# EAGLE design spine (EAGLE 9.4.2)

## Sheet 1 of 3: Leg COM
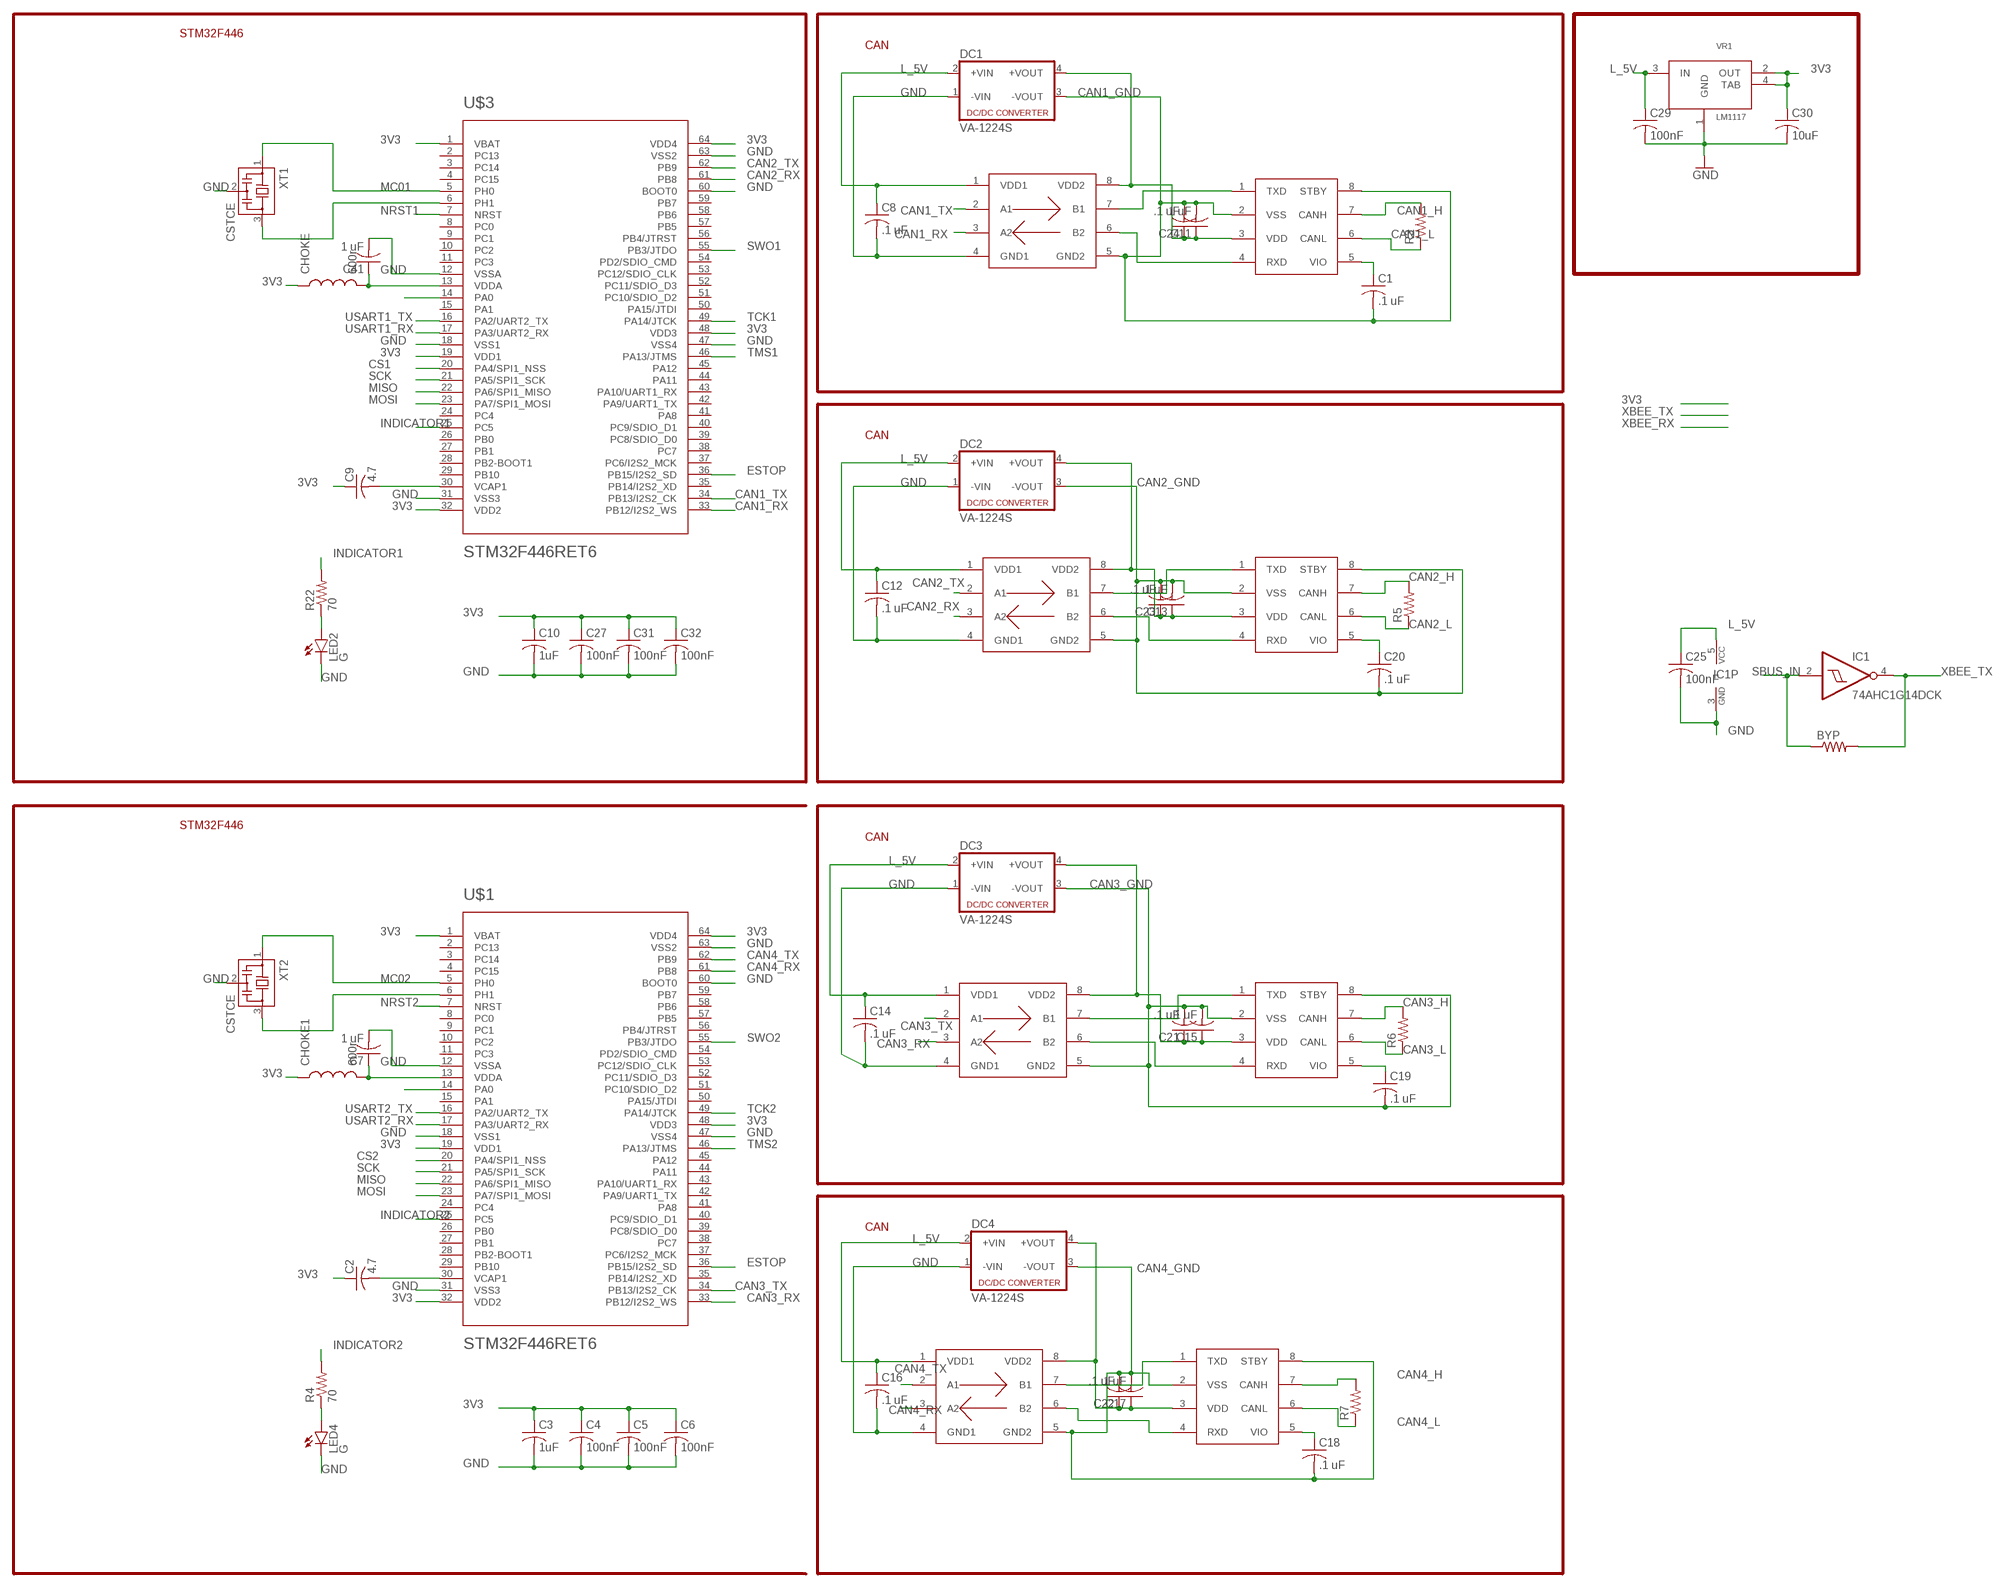
[diagram p0: schematic, sheet 1]

### Parts
BYP  R-US_R0402  [R0402]
C1  .1 uF  C-USC0603K  [C0603K]
C2  4.7  C-USC0603  [C0603]
C3  1uF  C-USC0603  [C0603]
C4  100nF  C-USC0603  [C0603]
C5  100nF  C-USC0603  [C0603]
C6  100nF  C-USC0603  [C0603]
C7  1 uF  C-USC0603  [C0603]
C8  .1 uF  C-USC0603K  [C0603K]
C9  4.7  C-USC0603  [C0603]
C10  1uF  C-USC0603  [C0603]
C11  1 uF  C-USC0603K  [C0603K]
C12  .1 uF  C-USC0603K  [C0603K]
C13  1 uF  C-USC0603K  [C0603K]
C14  .1 uF  C-USC0603K  [C0603K]
C15  1 uF  C-USC0603K  [C0603K]
C16  .1 uF  C-USC0603K  [C0603K]
C17  1 uF  C-USC0603K  [C0603K]
C18  .1 uF  C-USC0603K  [C0603K]
C19  .1 uF  C-USC0603K  [C0603K]
C20  .1 uF  C-USC0603K  [C0603K]
C21  .1 uF  C-USC0603K  [C0603K]
C22  .1 uF  C-USC0603K  [C0603K]
C23  .1 uF  C-USC0603K  [C0603K]
C24  .1 uF  C-USC0603K  [C0603K]
C25  100nF  C-USC0603  [C0603]
C27  100nF  C-USC0603  [C0603]
C29  100nF  C-USC0603  [C0603]
C30  10uF  C-USC0805K  [C0805K]
C31  100nF  C-USC0603  [C0603]
C32  100nF  C-USC0603  [C0603]
C41  1 uF  C-USC0603  [C0603]
CHOKE  600r  INDUCTOR0603  [0603]
CHOKE1  600r  INDUCTOR0603  [0603]
DC1  VA-1224S  [4SIL]
DC2  VA-1224S  [4SIL]
DC3  VA-1224S  [4SIL]
DC4  VA-1224S  [4SIL]
IC1  74AHC1G14DCK  [SC70-5]
LED2  G  LED0603  [LED-0603]
LED4  G  LED0603  [LED-0603]
R3  R-US_R0402  [R0402]
R4  70  R-US_R0603  [R0603]
R5  R-US_R0402  [R0402]
R6  R-US_R0402  [R0402]
R7  R-US_R0402  [R0402]
R22  70  R-US_R0603  [R0603]
U$1  STM32F446RET6  [TQFP64]
U$3  STM32F446RET6  [TQFP64]
U$4  MCP2561  [SO08]
U$5  MCP2561  [SO08]
U$6  MCP2561  [SO08]
U$7  MCP2561  [SO08]
U$8  SI8410  [SO08]
U$9  SI8410  [SO08]
U$10  SI8410  [SO08]
U$11  SI8410  [SO08]
VR1  LM1117  [SOT-223]
XT1  CSTCE  [CSTCE]
XT2  CSTCE  [CSTCE]

### Nets
3V3: C2.1 C3.1 C4.1 C5.1 C6.1 C9.1 C10.1 C27.1 C30.1 C31.1 C32.1 CHOKE1.1 CHOKE.1 U$1.1(VBAT) U$1.19(VDD1) U$1.32(VDD2) U$1.48(VDD3) U$1.64(VDD4) U$3.1(VBAT) U$3.19(VDD1) U$3.32(VDD2) U$3.48(VDD3) U$3.64(VDD4) VR1.2(OUT) VR1.4(TAB) ; also sheet 2
': C17.1 C22.1 DC4.4(+VOUT) U$7.3(VDD) U$11.8(VDD2)
CAN1_GND: C1.2 C11.2 C24.2 DC1.3(-VOUT) U$4.2(VSS) U$4.8(STBY) U$8.5(GND2) ; also sheet 2
CAN1_H: R3.2 U$4.7(CANH) ; also sheet 2
CAN1_L: R3.1 U$4.6(CANL) ; also sheet 2
CAN1_RX: U$3.33(PB12/I2S2_WS) U$8.3(A2)
CAN1_TX: U$3.34(PB13/I2S2_CK) U$8.2(A1)
CAN2_GND: C13.2 C20.2 C23.2 DC2.3(-VOUT) U$5.2(VSS) U$5.8(STBY) U$10.5(GND2) ; also sheet 2
CAN2_H: R5.2 U$5.7(CANH) ; also sheet 2
CAN2_L: R5.1 U$5.6(CANL) ; also sheet 2
CAN2_RX: U$3.61(PB8) U$10.3(A2)
CAN2_TX: U$3.62(PB9) U$10.2(A1)
CAN3_GND: C15.2 C19.2 C21.2 DC3.3(-VOUT) U$6.2(VSS) U$6.8(STBY) U$9.5(GND2) ; also sheet 2
CAN3_H: R6.2 U$6.7(CANH) ; also sheet 2
CAN3_L: R6.1 U$6.6(CANL) ; also sheet 2
CAN3_RX: U$1.33(PB12/I2S2_WS) U$9.3(A2)
CAN3_TX: U$1.34(PB13/I2S2_CK) U$9.2(A1)
CAN4_GND: C17.2 C18.2 C22.2 DC4.3(-VOUT) U$7.2(VSS) U$7.8(STBY) U$11.5(GND2) ; also sheet 2
CAN4_H: R7.2 U$7.7(CANH) ; also sheet 2
CAN4_L: R7.1 U$7.6(CANL) ; also sheet 2
CAN4_RX: U$1.61(PB8) U$11.3(A2)
CAN4_TX: U$1.62(PB9) U$11.2(A1)
CS1: U$3.20(PA4/SPI1_NSS) ; also sheet 3
CS2: U$1.20(PA4/SPI1_NSS) ; also sheet 3
ESTOP: U$1.36(PB15/I2S2_SD) U$3.36(PB15/I2S2_SD) ; also sheet 2
GND: C3.2 C4.2 C5.2 C6.2 C7.2 C8.2 C10.2 C12.2 C14.2 C16.2 C25.2 C27.2 C29.2 C30.2 C31.2 C32.2 C41.2 DC1.1(-VIN) DC2.1(-VIN) DC3.1(-VIN) DC4.1(-VIN) IC1.3(GND) LED2.C LED4.C U$1.12(VSSA) U$1.18(VSS1) U$1.31(VSS3) U$1.47(VSS4) U$1.60(BOOT0) U$1.63(VSS2) U$3.12(VSSA) U$3.18(VSS1) U$3.31(VSS3) U$3.47(VSS4) U$3.60(BOOT0) U$3.63(VSS2) U$8.4(GND1) U$9.4(GND1) U$10.4(GND1) U$11.4(GND1) VR1.1(GND) XT1.2 XT2.2 ; also sheet 2,3
INDICATOR1: R22.2 U$3.25(PC5)
INDICATOR2: R4.2 U$1.25(PC5)
L_5V: C8.1 C12.1 C14.1 C16.1 C25.1 C29.1 DC1.2(+VIN) DC2.2(+VIN) DC3.2(+VIN) DC4.2(+VIN) IC1.5(VCC) U$8.1(VDD1) U$9.1(VDD1) U$10.1(VDD1) U$11.1(VDD1) VR1.3(IN) ; also sheet 2,3
MC01: U$3.5(PH0) XT1.1
MC02: U$1.5(PH0) XT2.1
MISO: U$1.22(PA6/SPI1_MISO) U$3.22(PA6/SPI1_MISO) ; also sheet 3
MOSI: U$1.23(PA7/SPI1_MOSI) U$3.23(PA7/SPI1_MOSI) ; also sheet 3
N$1: U$1.14(PA0)
N$2: C41.1 CHOKE.2 U$3.13(VDDA)
N$3: C9.2 U$3.30(VCAP1)
N$4: C7.1 CHOKE1.2 U$1.13(VDDA)
N$5: C2.2 U$1.30(VCAP1)
N$6: C1.1 U$4.5(VIO)
N$7: LED4.A R4.1
N$8: U$1.6(PH1) XT2.3
N$10: C20.1 U$5.5(VIO)
N$11: C15.1 C21.1 DC3.4(+VOUT) U$6.3(VDD) U$9.8(VDD2)
N$12: C11.1 C24.1 DC1.4(+VOUT) U$4.3(VDD) U$8.8(VDD2)
N$14: U$4.1(TXD) U$8.7(B1)
N$15: U$7.1(TXD) U$11.7(B1)
N$16: U$4.4(RXD) U$8.6(B2)
N$17: U$7.4(RXD) U$11.6(B2)
N$18: C18.1 U$7.5(VIO)
N$19: C13.1 C23.1 DC2.4(+VOUT) U$5.3(VDD) U$10.8(VDD2)
N$20: U$5.1(TXD) U$10.7(B1)
N$21: U$5.4(RXD) U$10.6(B2)
N$22: C19.1 U$6.5(VIO)
N$24: U$3.14(PA0)
N$26: U$6.1(TXD) U$9.7(B1)
N$27: U$6.4(RXD) U$9.6(B2)
N$28: LED2.A R22.1
N$30: U$3.6(PH1) XT1.3
NRST1: U$3.7(NRST) ; also sheet 2
NRST2: U$1.7(NRST) ; also sheet 2
SBUS_IN: BYP.1 IC1.2(I) ; also sheet 2
SCK: U$1.21(PA5/SPI1_SCK) U$3.21(PA5/SPI1_SCK) ; also sheet 3
SWO1: U$3.55(PB3/JTDO)
SWO2: U$1.55(PB3/JTDO)
TCK1: U$3.49(PA14/JTCK) ; also sheet 2
TCK2: U$1.49(PA14/JTCK) ; also sheet 2
TMS1: U$3.46(PA13/JTMS) ; also sheet 2
TMS2: U$1.46(PA13/JTMS) ; also sheet 2
USART1_RX: U$3.17(PA3/UART2_RX) ; also sheet 2
USART1_TX: U$3.16(PA2/UART2_TX) ; also sheet 2
USART2_RX: U$1.17(PA3/UART2_RX) ; also sheet 2
USART2_TX: U$1.16(PA2/UART2_TX) ; also sheet 2
XBEE_TX: BYP.2 IC1.4(O) ; also sheet 3
Unconnected: U$1.2(PC13) U$1.3(PC14) U$1.4(PC15) U$1.8(PC0) U$1.9(PC1) U$1.10(PC2) U$1.11(PC3) U$1.15(PA1) U$1.24(PC4) U$1.26(PB0) U$1.27(PB1) U$1.28(PB2-BOOT1) U$1.29(PB10) U$1.35(PB14/I2S2_XD) U$1.37(PC6/I2S2_MCK) U$1.38(PC7) U$1.39(PC8/SDIO_D0) U$1.40(PC9/SDIO_D1) U$1.41(PA8) U$1.42(PA9/UART1_TX) U$1.43(PA10/UART1_RX) U$1.44(PA11) U$1.45(PA12) U$1.50(PA15/JTDI) U$1.51(PC10/SDIO_D2) U$1.52(PC11/SDIO_D3) U$1.53(PC12/SDIO_CLK) U$1.54(PD2/SDIO_CMD) U$1.56(PB4/JTRST) U$1.57(PB5) U$1.58(PB6) U$1.59(PB7) U$3.2(PC13) U$3.3(PC14) U$3.4(PC15) U$3.8(PC0) U$3.9(PC1) U$3.10(PC2) U$3.11(PC3) U$3.15(PA1) U$3.24(PC4) U$3.26(PB0) U$3.27(PB1) U$3.28(PB2-BOOT1) U$3.29(PB10) U$3.35(PB14/I2S2_XD) U$3.37(PC6/I2S2_MCK) U$3.38(PC7) U$3.39(PC8/SDIO_D0) U$3.40(PC9/SDIO_D1) U$3.41(PA8) U$3.42(PA9/UART1_TX) U$3.43(PA10/UART1_RX) U$3.44(PA11) U$3.45(PA12) U$3.50(PA15/JTDI) U$3.51(PC10/SDIO_D2) U$3.52(PC11/SDIO_D3) U$3.53(PC12/SDIO_CLK) U$3.54(PD2/SDIO_CMD) U$3.56(PB4/JTRST) U$3.57(PB5) U$3.58(PB6) U$3.59(PB7)

### Notes on the sheet
- STM32F446
- CAN
- CAN
- STM32F446
- CAN
- CAN

## Sheet 2 of 3: Connectors
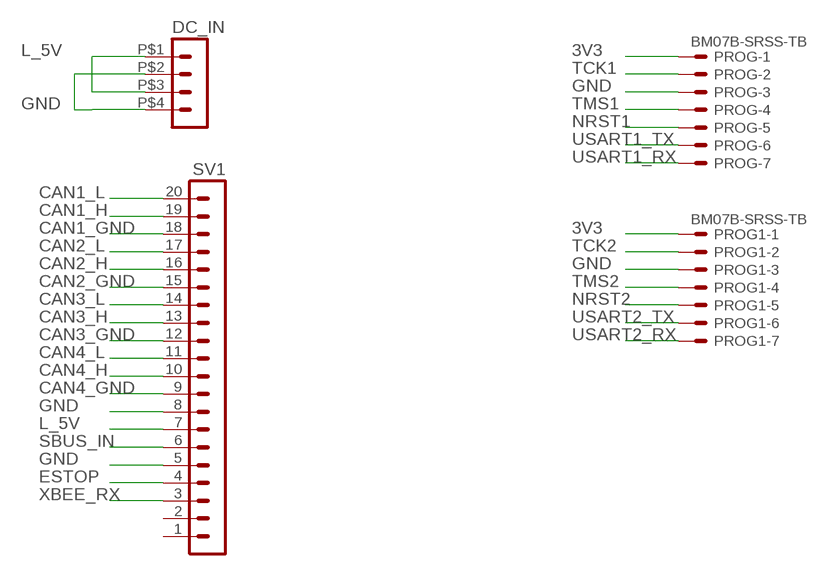
[diagram p1: schematic, sheet 2]

### Parts
DC_IN  HEADER_POS4_43045-0401  [43045-0400]
PROG  BM07B-SRSS-TB  [BM07B-SRSS-TB]
PROG1  BM07B-SRSS-TB  [BM07B-SRSS-TB]
SV1  MA20-1L  [MA20-1L]

### Nets
3V3: PROG1.1 PROG.1 ; also sheet 1
CAN1_GND: SV1.18 ; also sheet 1
CAN1_H: SV1.19 ; also sheet 1
CAN1_L: SV1.20 ; also sheet 1
CAN2_GND: SV1.15 ; also sheet 1
CAN2_H: SV1.16 ; also sheet 1
CAN2_L: SV1.17 ; also sheet 1
CAN3_GND: SV1.12 ; also sheet 1
CAN3_H: SV1.13 ; also sheet 1
CAN3_L: SV1.14 ; also sheet 1
CAN4_GND: SV1.9 ; also sheet 1
CAN4_H: SV1.10 ; also sheet 1
CAN4_L: SV1.11 ; also sheet 1
ESTOP: SV1.4 ; also sheet 1
GND: DC_IN.P$2 DC_IN.P$4 PROG1.3 PROG.3 SV1.5 SV1.8 ; also sheet 1,3
L_5V: DC_IN.P$1 DC_IN.P$3 SV1.7 ; also sheet 1,3
NRST1: PROG.5 ; also sheet 1
NRST2: PROG1.5 ; also sheet 1
SBUS_IN: SV1.6 ; also sheet 1
TCK1: PROG.2 ; also sheet 1
TCK2: PROG1.2 ; also sheet 1
TMS1: PROG.4 ; also sheet 1
TMS2: PROG1.4 ; also sheet 1
USART1_RX: PROG.7 ; also sheet 1
USART1_TX: PROG.6 ; also sheet 1
USART2_RX: PROG1.7 ; also sheet 1
USART2_TX: PROG1.6 ; also sheet 1
XBEE_RX: SV1.3 ; also sheet 1,3
Unconnected: SV1.1 SV1.2

## Sheet 3 of 3: UP Board
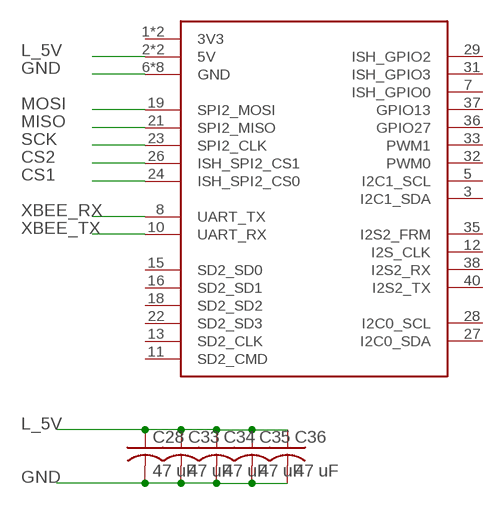
[diagram p2: schematic, sheet 3]

### Parts
C28  47 uF  C-USC1206K  [C1206K]
C33  47 uF  C-USC1206K  [C1206K]
C34  47 uF  C-USC1206K  [C1206K]
C35  47 uF  C-USC1206K  [C1206K]
C36  47 uF  C-USC1206K  [C1206K]
U$2  UP_BOARD  [UP_BOARD]

### Nets
CS1: U$2.24(ISH_SPI2_CS0) ; also sheet 1
CS2: U$2.26(ISH_SPI2_CS1) ; also sheet 1
GND: C28.2 C33.2 C34.2 C35.2 C36.2 U$2.6(GND) U$2.9(GND) U$2.14(GND) U$2.20(GND) U$2.25(GND) U$2.30(GND) U$2.34(GND) U$2.39(GND) ; also sheet 1,2
L_5V: C28.1 C33.1 C34.1 C35.1 C36.1 U$2.2(5V) U$2.4(5V) ; also sheet 1,2
MISO: U$2.21(SPI2_MISO) ; also sheet 1
MOSI: U$2.19(SPI2_MOSI) ; also sheet 1
SCK: U$2.23(SPI2_CLK) ; also sheet 1
XBEE_RX: U$2.8(UART_TX) ; also sheet 1,2
XBEE_TX: U$2.10(UART_RX) ; also sheet 1
Unconnected: U$2.1(3V3) U$2.3(I2C1_SDA) U$2.5(I2C1_SCL) U$2.7(ISH_GPIO0) U$2.11(SD2_CMD) U$2.12(I2S_CLK) U$2.13(SD2_CLK) U$2.15(SD2_SD0) U$2.16(SD2_SD1) U$2.17(3V3) U$2.18(SD2_SD2) U$2.22(SD2_SD3) U$2.27(I2C0_SDA) U$2.28(I2C0_SCL) U$2.29(ISH_GPIO2) U$2.31(ISH_GPIO3) U$2.32(PWM0) U$2.33(PWM1) U$2.35(I2S2_FRM) U$2.36(GPIO27) U$2.37(GPIO13) U$2.38(I2S2_RX) U$2.40(I2S2_TX)

## Library data of the parts
BYP = rcl:R-US_: RESISTOR, American symbol; SPICEPREFIX: R
C1-C25 C27-C36 C41 = rcl:C-US: CAPACITOR, American symbol
CHOKE CHOKE1 = SparkFun-Passives:INDUCTOR: Inductors Basic Inductor/Choke - 0603 and 1206. Footprints are not proven and vary greatly between part numbers. INDUCTOR POWER 3.3UH 4.0A SMD 0.197" L x 0.197" W x 0.177" H (5.00mm x 5.00mm x 4.50mm)
DC1-DC4 = dc-dc-converter:VA-*?: DC DC Converter Single Output, 1 Watt Motien Technology Co.,Ltd. Source: Data sheet <http://www.motien.com.tw/data_sheet/VA-1%28H%29.pdf>; OC_FARNELL: unknown; OC_NEWARK: unknown
DC_IN = con-molex-micro-fit-3_0:HEADER_POS4_?: Molex - Micro-Fit 3.0 Series connector, 3.00mm (0.118") pitch header, 4 positions.
IC1 = 74xx-little-us:74*1G14: Single Schmitt-Trigger Inverter Gate
LED2 LED4 = SparkFun-LED:LED: LEDs Standard schematic elements and footprints for 5mm, 3mm, 1206, and 0603 sized LEDs. 5mm - Spark Fun Electronics SKU : COM-00529 (and others)
PROG PROG1 = con-jst2:?M07B-SRSS-TB: Disconnectable Crimp style connector, 1.0mm pitch 7 contacts
R3-R7 R22 = rcl:R-US_: RESISTOR, American symbol
SV1 = con-lstb:MA20-1L: PIN HEADER; OC_FARNELL: unknown; OC_NEWARK: unknown
U$1 U$3 = BenLibrary:STM32F446RET6: ARM DSP Chip used on the WAV Trigger board.
U$2 = BenLibrary:UP_BOARD
U$4-U$7 = BenLibrary:MCP2561
U$8-U$11 = BenLibrary:SI8410
VR1 = sc_usercreated:LM1117
XT1 XT2 = sc_usercreated:CSTCE

## Board
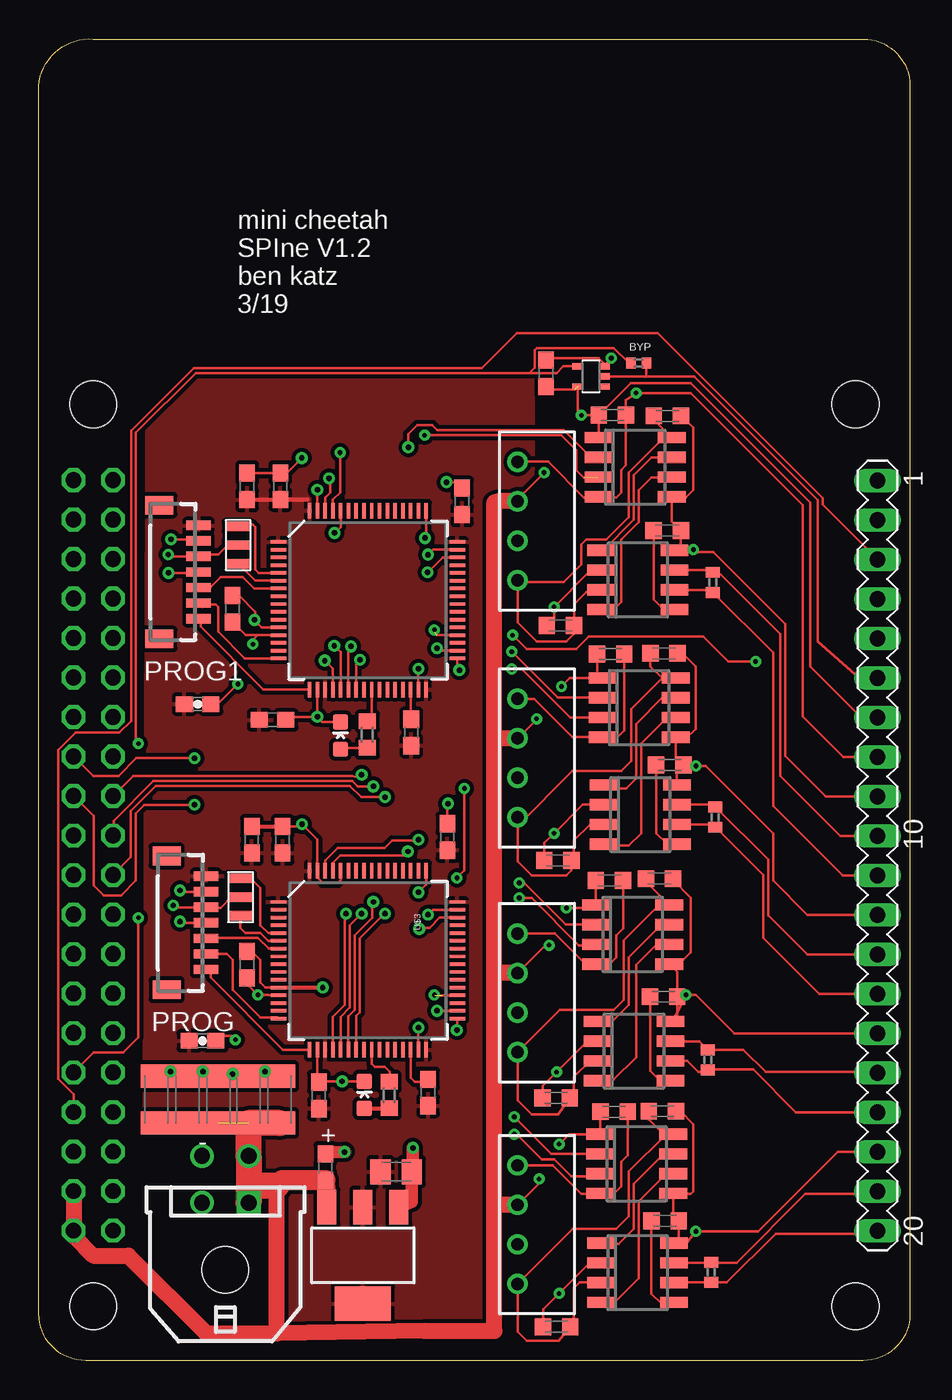
[diagram p3: board, top side]
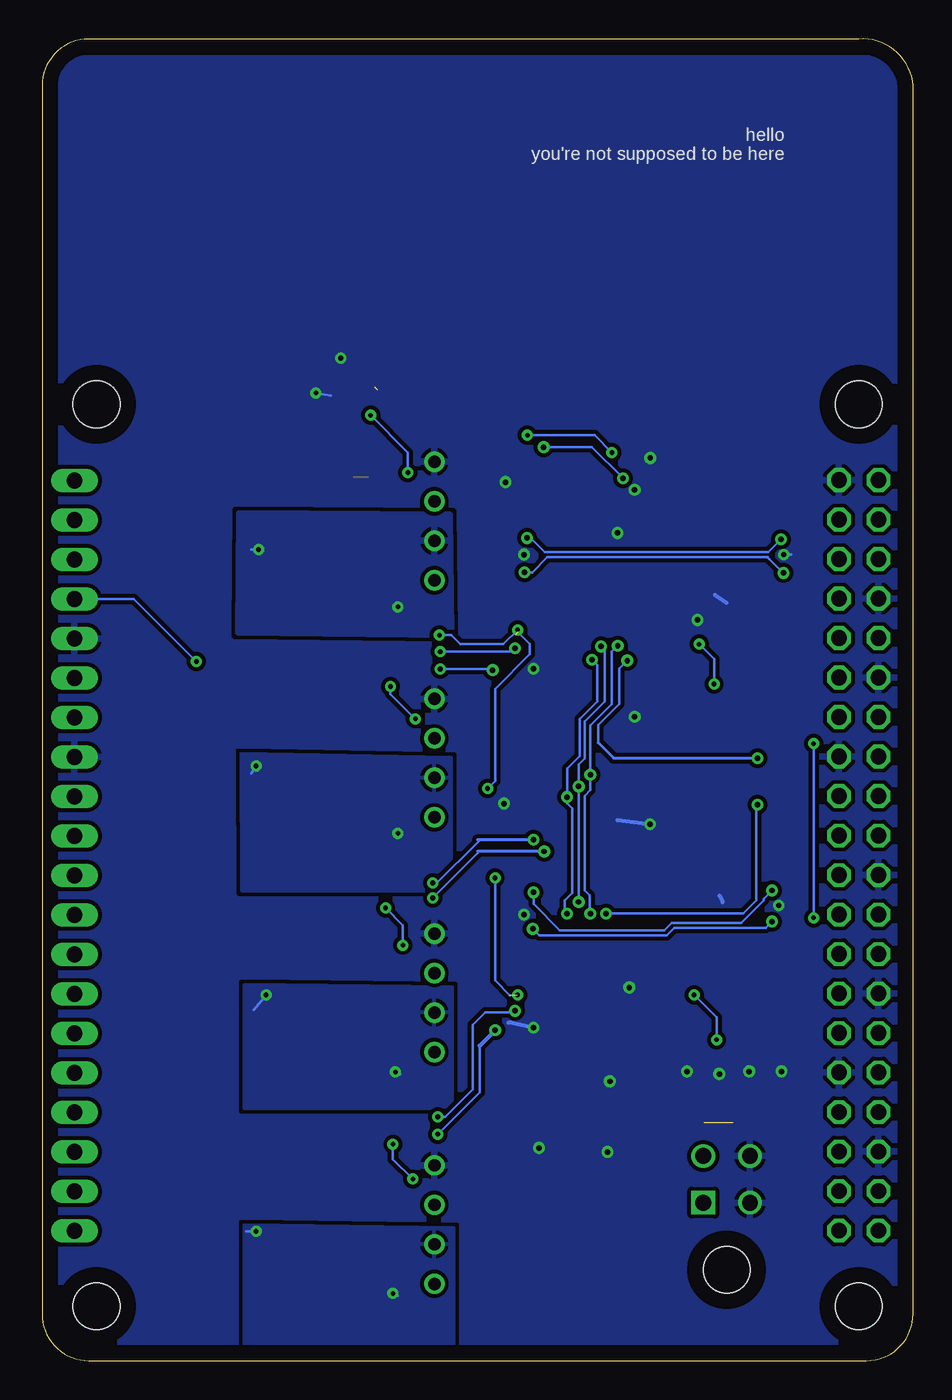
[diagram p4: board, bottom side, seen from below]

Size 56 x 85.01 mm. Coordinates in mm from the lower left corner, seen from the top.
Copper layers (1*16): Top 0.035mm / dielectric 1.5mm / Bottom 0.035mm
Design rules "default *": minimum track width 6mil, minimum drill 0.3mm, track to track 6mil, track to pad 6mil, pad to pad 6mil, via to via 6mil, smd to smd 6mil, copper to edge 40mil, drill to drill 6mil, minimum pad ring 10mil, minimum via ring 8mil, stop-mask expansion 4mil, vias tented up to drill 0mil, thermal gap 10mil

### Footprints (pad centres in the part's own frame; a part is rotated, then mirrored left to right if it is on the bottom)
R0402 = smd 0.6 x 0.7: 1 -0.5,0; 2 0.5,0
C0603K = smd 1.05 x 1.08: 1 -0.875,0; 2 0.875,0
C0603 = smd 1.1 x 1: 1 -0.85,0; 2 0.85,0
C1206K = smd 1.5 x 2: 1 -1.5,0; 2 1.5,0
C0805K = smd 1.3 x 1.6: 1 -1,0; 2 1,0
0603 = smd 1.1 x 1: 1 -0.85,0; 2 0.85,0
4SIL = drill 0.8: 1 -3.81,0; 2 -1.27,0; 3 1.27,0; 4 3.81,0
43045-0400 = drill 1.02 square: P$1 1.5,4.32 | drill 1.02: P$2 -1.5,4.32; P$3 1.5,7.32; P$4 -1.5,7.32 | hole 3: 0,0
SC70-5 = smd 0.4 x 0.7: 1 -0.65,-0.85; 2 0,-0.85; 3 0.65,-0.85; 4 0.65,0.85; 5 -0.65,0.85
LED-0603 = smd 1 x 1: A 0,-0.877; C 0,0.877
BM07B-SRSS-TB = smd 0.6 x 1.55: 1 3,-1.625; 2 2,-1.625; 3 1,-1.625; 4 0,-1.625; 5 -1,-1.625; 6 -2,-1.625; 7 -3,-1.625 | smd 1.2 x 1.8: FIT@1 4.3,0.9; FIT@2 -4.3,0.9
R0402' = smd 0.7 x 0.9: 1 -0.65,0; 2 0.65,0
R0603 = smd 1 x 1.1: 1 -0.85,0; 2 0.85,0
MA20-1L = drill 1.016 long: 1 24.13,0; 2 21.59,0; 3 19.05,0; 4 16.51,0; 5 13.97,0; 6 11.43,0; 7 8.89,0; 8 6.35,0; 9 3.81,0; 10 1.27,0; 11 -1.27,0; 12 -3.81,0; 13 -6.35,0; 14 -8.89,0; 15 -11.43,0; 16 -13.97,0; 17 -16.51,0; 18 -19.05,0; 19 -21.59,0; 20 -24.13,0
TQFP64 = smd 0.22 x 1: 1 -3.75,-5.75; 2 -3.25,-5.75; 3 -2.75,-5.75; 4 -2.25,-5.75; 5 -1.75,-5.75; 6 -1.25,-5.75; 7 -0.75,-5.75; 8 -0.25,-5.75; 9 0.25,-5.75; 10 0.75,-5.75; 11 1.25,-5.75; 12 1.75,-5.75; 13 2.25,-5.75; 14 2.75,-5.75; 15 3.25,-5.75; 16 3.75,-5.75; 33 3.75,5.75; 34 3.25,5.75; 35 2.75,5.75; 36 2.25,5.75; 37 1.75,5.75; 38 1.25,5.75; 39 0.75,5.75; 40 0.25,5.75; 41 -0.25,5.75; 42 -0.75,5.75; 43 -1.25,5.75; 44 -1.75,5.75; 45 -2.25,5.75; 46 -2.75,5.75; 47 -3.25,5.75; 48 -3.75,5.75 | smd 1 x 0.22: 17 5.75,-3.75; 18 5.75,-3.25; 19 5.75,-2.75; 20 5.75,-2.25; 21 5.75,-1.75; 22 5.75,-1.25; 23 5.75,-0.75; 24 5.75,-0.25; 25 5.75,0.25; 26 5.75,0.75; 27 5.75,1.25; 28 5.75,1.75; 29 5.75,2.25; 30 5.75,2.75; 31 5.75,3.25; 32 5.75,3.75; 49 -5.75,3.75; 50 -5.75,3.25; 51 -5.75,2.75; 52 -5.75,2.25; 53 -5.75,1.75; 54 -5.75,1.25; 55 -5.75,0.75; 56 -5.75,0.25; 57 -5.75,-0.25; 58 -5.75,-0.75; 59 -5.75,-1.25; 60 -5.75,-1.75; 61 -5.75,-2.25; 62 -5.75,-2.75; 63 -5.75,-3.25; 64 -5.75,-3.75
UP_BOARD = drill 1.016 octagon: 1 8.37,51.23; 2 8.37,53.77; 3 10.91,51.23; 4 10.91,53.77; 5 13.45,51.23; 6 13.45,53.77; 7 15.99,51.23; 8 15.99,53.77; 9 18.53,51.23; 10 18.53,53.77; 11 21.07,51.23; 12 21.07,53.77; 13 23.61,51.23; 14 23.61,53.77; 15 26.15,51.23; 16 26.15,53.77; 17 28.69,51.23; 18 28.69,53.77; 19 31.23,51.23; 20 31.23,53.77; 21 33.77,51.23; 22 33.77,53.77; 23 36.31,51.23; 24 36.31,53.77; 25 38.85,51.23; 26 38.85,53.77; 27 41.39,51.23; 28 41.39,53.77; 29 43.93,51.23; 30 43.93,53.77; 31 46.47,51.23; 32 46.47,53.77; 33 49.01,51.23; 34 49.01,53.77; 35 51.55,51.23; 36 51.55,53.77; 37 54.09,51.23; 38 54.09,53.77; 39 56.63,51.23; 40 56.63,53.77 | hole 3: 3.5,52.5; 61.5,52.5; 61.5,3.5; 3.5,3.5
SO08 = smd 0.72 x 1.78: 1 -1.905,-2.35; 2 -0.635,-2.35; 3 0.635,-2.35; 4 1.905,-2.35; 5 1.905,2.35; 6 0.635,2.35; 7 -0.635,2.35; 8 -1.905,2.35
SOT-223 = smd 1.219 x 2.235: 1 -2.311,-3.099; 2 0,-3.099; 3 2.311,-3.099 | smd 3.6 x 2.2: 4 0,3.099
CSTCE = smd 0.6 x 1.6: 1 -1.2,0; 2 0,0; 3 1.2,0

### Placement (x,y rotation side)
BYP  38.56,64.16 180 top
C1  40.26,9 0 top
C2  23.94,40.4 90 top
C3  13.39,56.23 90 top
C4  15.53,56.24 90 top
C5  27.21,55.26 90 top
C6  15.03,41.21 0 top
C7  12.46,48.35 90 top
C8  36.98,16.01 0 top
C9  25.02,17.25 90 top
C10  13.69,33.5 90 top
C11  33.29,2.18 180 top
C12  36.68,30.89 0 top
C13  33.26,16.9 180 top
C14  36.76,45.45 0 top
C15  33.37,32.17 180 top
C16  36.87,60.81 0 top
C17  33.53,47.28 180 top
C18  40.4,53.39 0 top
C19  40.56,38.3 0 top
C20  40.17,23.41 0 top
C21  40.19,45.49 0 top
C22  40.41,60.76 0 top
C23  39.9,31 0 top
C24  40.09,16.05 0 top
C25  32.61,63.5 90 top
C27  15.67,33.5 90 top
C28  13.47,16.79 90 top
C29  18.42,12.45 90 top
C30  22.97,12.15 0 top
C31  26.26,33.68 90 top
C32  18,17.06 90 top
C33  15.47,16.79 90 top
C34  11.55,16.79 90 top
C35  9.55,16.79 90 top
C36  7.55,16.79 90 top
C41  13.38,25.47 90 top
CHOKE  10.52,20.57 0 top
CHOKE1  10.21,42.22 0 top
DC1  30.78,8.75 270 top
DC2  30.78,23.66 270 top
DC3  30.78,38.75 270 top
DC4  30.78,54 270 top
DC_IN  11.99,5.84 0 top
IC1  35.5,63.3 90 top
LED2  20.93,17.09 0 top
LED4  19.39,40.2 0 top
PROG  9.12,28.16 90 top
PROG1  8.64,50.72 90 top
R3  [R0402']  43.24,5.68 90 top
R4  21.12,40.26 90 top
R5  [R0402']  43.01,19.34 90 top
R6  [R0402']  43.49,34.96 90 top
R7  [R0402']  43.33,50.05 90 top
R22  22.52,17.09 90 top
SV1  53.92,32.48 90 top
U$1  21.15,48.91 270 top
U$2  56,0 90 top
U$3  21.15,25.75 270 top
U$4  38.49,5.66 270 top
U$5  38.26,19.91 270 top
U$6  38.67,35.12 270 top
U$7  38.51,50.21 270 top
U$8  38.43,12.66 270 top
U$9  38.59,42 270 top
U$10  38.18,27.41 270 top
U$11  38.34,57.46 270 top
VR1  20.83,6.77 180 top
XT1  12.97,29.81 270 top
XT2  12.81,52.45 270 top

### Tracks (layer width: path | path; a pad name or v marks a point on that pad's centre or on a via)
3V3
  Top 0.25: C3.1 17.28,55.38 C4.1
  pour Top (isolate 0.25): 7,63.75 31.75,63.75 31.75,1.25 6.75,1.25
'
  Top 0.16: C22.1 39.53,60.52 U$11.8 40.16,59.37 37.92,57.12 37.92,54.24 36.48,52.8 35.2,52.8 34.88,52.48 34.88,51.2 33.76,50.08 30.89,50.08 DC4.4 30.78,47.46 32,46.24 33.92,46.24 34.4,46.72 C17.1 34.41,48.65 35.2,49.44 36.02,49.44 U$7.3
CAN1_GND  (via drill 0.3)
  Top 0.16: C24.2 41.23,16.05 42.08,15.2 42.08,10.88 41.92,10.72 40.81,10.72 U$8.5 40.78,9.36 C1.2 41.13,7.86 U$4.8 41.65,7.57 v42.24,8.32 46.24,8.32 51.35,13.43 SV1.18 | U$4.2 35.41,6.29 v33.44,4.32 32.41,3.29 C11.2
  Bottom 0.16: v42.24,8.32 42.88,8.32 | v33.44,4.32 33.12,4.16
  pour Bottom (isolate 0.254): 29.53,8.5 43,8.71 43,1 29.53,1
CAN1_H
  Top 0.16: R3.2 43.24,6.29 U$4.7 44.85,6.29 49.28,10.72 53.75,10.72 SV1.19
CAN1_L
  Top 0.16: U$4.6 R3.1 44.23,5.03 47.36,8.16 53.73,8.16 SV1.20
CAN1_RX  (via drill 0.3, 0.35)
  Top 0.16: U$3.33 26.9,21.28 v26.87,21.25 | v30.56,14.56 30.72,14.56 32.32,12.96 33.12,12.96 34.24,11.84 35.9,11.84 U$8.3
  Bottom 0.16: 27.87,20.25 27.87,17.25 v30.56,14.56
  Bottom 0.25: 27.87,20.25 v26.87,21.25
CAN1_TX  (via drill 0.3, 0.35)
  Top 0.16: v25.59,22.5 U$3.34 | U$8.2 32.95,13.29 v30.56,15.68
  Bottom 0.16: v30.56,15.68 30.08,15.68 28.32,17.44 28.32,21.6 27.52,22.4 25.69,22.4 v25.59,22.5
CAN2_GND  (via drill 0.3)
  Top 0.16: U$5.2 35.27,20.55 v33.28,18.56 32.38,17.66 C13.2 | C23.2 40.77,30.91 41.92,29.76 41.92,26.24 41.12,25.44 40.59,25.44 U$10.5 41.05,24.99 C20.2 41.05,22.25 U$5.8 41.02,22.3 v41.6,23.52 42.24,23.52 44.71,21.05 SV1.15
  Bottom 0.16: v41.6,23.52 42.4,22.56 | v33.28,18.56 33.12,18.56 32.96,18.4
  pour Bottom (isolate 0.254): 29.62,24 43,24.15 43,16.25 29.62,16.25
CAN2_H
  Top 0.16: U$5.7 42.45,20.55 R5.2 45.29,19.99 46.72,18.56 53.87,18.56 SV1.16
CAN2_L
  Top 0.16: SV1.17 48.67,15.97 45.92,18.72 43.04,18.72 R5.1 42.88,18.56 42.4,18.56 41.69,19.27 U$5.6
CAN2_RX  (via drill 0.3, 0.35)
  Top 0.16: U$3.61 18.9,32.02 19.36,32.48 23.45,32.48 v23.72,32.75 | v30.88,29.76 31.68,29.76 34.72,26.72 35.77,26.72 U$10.3
  Bottom 0.16: 28,32.75 28,32.64 v30.88,29.76
  Bottom 0.2: v23.72,32.75 28,32.75
CAN2_TX  (via drill 0.3, 0.35)
  Top 0.16: U$3.62 18.4,32.16 19.2,32.96 22.24,32.96 22.72,33.44 24.34,33.44 v24.4,33.5 | U$10.2 33.88,28.05 31.2,30.72 v30.88,30.72
  Bottom 0.16: v30.88,30.72 30.78,30.56 27.84,33.5
  Bottom 0.2: v24.4,33.5 27.84,33.5 28,33.5
CAN3_GND  (via drill 0.3)
  Top 0.16: U$6.2 34.95,35.76 v33.12,33.92 32.49,33.3 C15.2 | C21.2 41.39,45.49 42.24,44.64 42.24,40.64 41.6,40 41.03,40 U$9.5 40.94,38.8 C19.2 41.02,37.88 U$6.8 41.02,38.15 v42.24,38.24 42.88,38.24 47.2,33.92 47.2,30.88 49.41,28.67 SV1.12
  Bottom 0.16: v33.12,33.92 32.96,33.76 | v42.24,38.24 42.56,37.76
  pour Bottom (isolate 0.254): 29.69,38.75 43.21,39.03 43.16,30.25 29.69,30.25
CAN3_H
  Top 0.16: U$6.7 43.34,35.76 R6.2 46.88,32.22 46.88,28.64 49.39,26.13 SV1.13
CAN3_L
  Top 0.16: U$6.6 43.31,34.48 R6.1 46.56,31.24 46.56,27.2 50.17,23.59 SV1.14
CAN3_RX  (via drill 0.3, 0.35)
  Top 0.16: U$1.33 26.9,44.54 v27.03,44.41 | U$9.3 34.16,41.37 31.04,44.48 v30.4,44.48
  Bottom 0.16: v30.4,44.48 27.1,44.48 v27.03,44.41
CAN3_TX  (via drill 0.3, 0.35)
  Top 0.16: U$1.34 25.43,45.66 v25.59,45.82 | U$9.2 33.37,42.63 v30.4,45.6
  Bottom 0.16: v30.4,45.6 25.81,45.6 v25.59,45.82
CAN4_GND  (via drill 0.3)
  Top 0.16: U$7.2 35.33,50.84 35.33,50.69 v33.12,48.48 33.12,47.74 C17.2 32.64,47.3 | C22.2 41.32,60.76 42.08,60 42.08,56 41.6,55.52 40.73,55.52 U$11.5 40.69,53.98 C18.2 41.27,53.44 41.28,53.44 41.28,52.53 U$7.8 42.03,52.12 v42.08,52.16 42.24,52 43.36,52 48,47.36 48,38.88 50.59,36.29 SV1.9
  Bottom 0.16: v42.08,52.16 42.56,52.16
  pour Bottom (isolate 0.254): 29.78,54.41 43.32,54.52 43.39,46.82 29.69,46.66
CAN4_H
  Top 0.16: U$7.7 43.19,50.84 R7.2 43.47,50.56 43.84,50.56 47.68,46.72 47.68,37.6 51.53,33.75 SV1.10
CAN4_L
  Top 0.16: U$7.6 43.16,49.58 R7.1 47.2,45.53 47.2,35.68 51.67,31.21 SV1.11
CAN4_RX  (via drill 0.3)  (1 unrouted)
  Top 0.16: U$1.61 18.9,55.38 19.36,55.84 v19.36,58.4 | v24.8,59.52 33.6,59.52 34.56,58.56 34.56,57.28 35.04,56.8
  Bottom 0.16: v24.8,59.52 20.48,59.52 v19.36,58.4
CAN4_TX  (via drill 0.35)
  Top 0.16: U$1.62 18.4,55.52 18.72,55.84 18.72,56.68 v18.65,56.75 | v23.75,58.75 23.75,59.59 24.32,60.16 25.28,60.16 25.6,59.84 33.76,59.84 35.2,58.4 35.69,58.4 U$11.2
  Bottom 0.16: v23.75,58.75 20.65,58.75 v18.65,56.75
CS1  (via drill 0.35)
  Top 0.16: U$3.20 18.9,22.1 19.68,22.88 19.68,28.68 v19.75,28.75 | v10,35.75 6.79,35.75 6.24,35.2 6.24,30.88 5.28,29.92 4.16,29.92 3.52,30.56 3.52,35.02 U$2.24
  Bottom 0.16: v19.75,28.75 10.93,28.75 10.08,29.6 10.08,35.67 v10,35.75
CS2  (via drill 0.35)
  Top 0.16: v10,38.75 6.27,38.75 5.12,37.6 3.48,37.6 U$2.26 | U$1.20 18.9,44.5 v18.38,45.02
  Bottom 0.16: 20.25,39.75 20.25,40.87 18.88,42.24 18.88,44.52 v18.38,45.02
  Bottom 0.2: 20.25,39.75 19.25,38.75 v10,38.75
  Bottom 0.25: U$2.26 2.23,38.77
ESTOP  (via drill 0.3)  (2 unrouted)
  Top 0.16: U$1.36 25.57,46.66 | U$3.36 25.45,23.5 v25.43,23.52 | v27.36,36.8 27.36,31.52 v26.88,31.04 | v46.08,44.96 44.32,44.96 42.72,46.56 35.36,46.56 34.56,45.76 31.36,45.76 v30.46,46.66
  Bottom 0.16: v27.36,36.8 26.88,37.28 26.88,43.2 24.64,45.44 24.64,46.08 25.43,46.87 v25.43,47 26.35,46.08 29.12,46.08 29.7,46.66 v30.46,46.66 | v26.88,31.04 26.88,24.46 25.92,23.5 | SV1.4 50.11,48.99 v46.08,44.96
GND  (via drill 0.3, 0.35)
  Top 0.16: 12.44,29.9 13.06,29.9 XT1.2 12.37,29.81 11.68,29.12 10.79,29.12 PROG.3 8.76,29.16 v8.64,29.28 | C41.2 13.68,26.32 14.24,25.76 14.24,24.32 14.56,24 U$3.12 | C27.2 16.77,34.35 v16.92,34.5 17.9,33.52 U$3.63 17.92,31.48 17.92,31.04 18.24,30.72 19.2,30.72 19.4,30.92 U$3.60 | C31.2 26.26,35.23 v26.3,35.83 | U$3.31 v24.4,21.41 | U$3.18 17.9,18.01 C32.2 18.05,17.96 v19.5,17.96 v19.51,17.97 LED2.C | C33.2 14.85,18.29 v14.54,18.6 | C34.2 11.47,18.29 11.36,18.4 10.74,18.4 v10.54,18.6 | v8.46,18.6 9.24,18.6 C35.2 | U$1.12 14.34,47.16 v13.86,47.64 13.92,47.7 13.92,48.16 12.88,49.2 C7.2 | v8.32,51.84 8.44,51.72 PROG1.3 10.38,51.84 11.52,51.84 12.13,52.45 XT2.2 | U$1.60 19.4,53.62 v19.01,53.23 | v16.9,58.05 15.94,57.09 C4.2 C3.2 | U$1.63 v17.9,56 | U$1.18 v17.9,41.41 | LED4.C 18.23,41.08 v17.9,41.41 | v17.9,41.41 16.08,41.41 C6.2 | U$1.31 v24.4,44.5 | C5.2 27.21,56.46 v26.21,56.5 | U$1.47 25.34,52.16 v25.02,51.84 | U$3.47 25.33,29 v25.01,28.68 | DC4.1 32.75,57.81 35.04,55.52 35.95,55.52 U$11.4 36.02,55.52 37.12,55.52 37.44,55.84 37.44,57.28 37.74,57.59 C16.2 37.74,61.77 v38.4,62.24 41.92,62.24 49.12,55.04 49.12,41.44 51.73,38.83 SV1.8 | C25.2 32.94,64.48 36,64.48 36.35,64.13 IC1.3 36.35,64.03 v36.8,64.48 | DC3.1 31.84,42.56 34.3,40.09 U$9.4 36.34,40 37.12,40 37.63,40.52 C14.2 | C12.2 37.55,27.8 37.12,27.36 37.12,25.92 36.8,25.6 35.92,25.6 U$10.4 35.73,25.6 35.04,25.6 33.17,27.47 DC2.1 | C8.2 37.85,13.21 37.44,12.8 37.44,11.2 36.96,10.72 36.12,10.72 U$8.4 36.05,10.72 34.88,10.72 33.04,12.56 DC1.1
  Top 0.25: LED4.C 19.48,41.08 | U$3.12 v18.25,24 | C10.2 C27.2 | 21.12,18 LED2.C
  Top 0.813: v19.65,13.42 18.53,13.41 C29.2 | VR1.1 23.97,10.22 C30.2 24,12.18 24,12.32 24.08,12.08 v24.05,13.68
  Top 1.016: C36.2 C35.2 | C28.2 C33.2
  Bottom 0.16: v8.32,51.84 7.84,51.84 | v8.64,29.28 8.48,29.44 | v38.4,62.24 37.44,62.08 | v36.8,64.48 36.64,64.64
  Bottom 0.25: 12.75,49.25 12,48.75 | v24.4,21.41 26,21.75 | v18.25,24 18.5,24 | v16.92,34.5 19,34.75 | 12.44,29.9 12.25,29.5
  other vias: 12.46,18.44
  pour Bottom (isolate 0.254, rank 3): 0,84.35 56,84.35 56,0 0,0
INDICATOR1
  Top 0.16: U$3.25 21.4,19.08 21.6,18.88 22.24,18.88 22.56,18.56 22.56,17.98 R22.2
INDICATOR2
  Top 0.16: U$1.25 21.4,41.39 R4.2
L_5V  (via drill 0.3)  (2 unrouted)
  Top 0.16: C28.1 14.47,15.29 14.88,14.88 | C16.1 U$11.1 | DC4.2 30.78,55.42 v32.48,57.12 | C16.1 v34.88,60.8 34.65,61.03 IC1.5 | C14.1 35.88,44.26 U$9.1 34.15,43.91 v33.6,43.36 | v32,41.28 32.16,41.4 DC3.2 | C12.1 35.8,29.34 U$10.1 35.63,29.12 v33.92,29.12 | 30.85,24.93 DC2.2 32.57,26.72 v32.8,26.72 | C8.1 36.1,14.59 U$8.1 34.09,14.56 v33.44,13.92 | v32.16,11.68 32.16,11.4 DC1.2 | 34.45,62.45 32.81,62.45 C25.1 | SV1.7 52.87,41.37 49.6,44.64 49.6,55.2 41.92,62.88 38.06,62.88 C16.1
  Top 0.406: C29.1 18.65,10.98 VR1.3
  Top 1.016: 18.54,11.25 VR1.3 | U$2.2 U$2.4 2.23,8.02 3.5,6.75 5.75,6.75 10.75,1.75 15.29,1.75 | 15.29,1.75 15.29,11.25 | 15.29,1.75 24.84,1.91 29.28,1.91 29.28,10.24 | C36.1 C35.1 C34.1 | 29.28,10.24 29.28,24.96 | 29.28,24.96 29.28,40.32 | 29.28,40.32 29.28,55.04 | 29.28,55.04 29.28,55.2 | DC4.2 29.51,55.27 29.28,55.04 | DC3.2 29.58,40.02 29.28,40.32 | DC2.2 29.31,24.93 29.28,24.96 | DC1.2 29.5,10.02 29.28,10.24
  Top 1.27: C29.1 15.64,11.6 15.29,11.25
  Top 1.676: C33.1 C28.1 13.47,13.18 DC_IN.P$3 13.49,11.04 | 13.49,11.04 DC_IN.P$1 | 15.29,11.25 13.7,11.25 13.49,11.04
  Bottom 0.16: v32.48,57.12 32.48,58.4 v34.88,60.8 | v33.6,43.36 33.6,42.88 v32,41.28 | v32.8,26.72 32.8,28 v33.92,29.12 | v33.44,13.92 33.44,12.96 v32.16,11.68
MC01
  Top 0.16: U$3.5 14.74,27.5 14.24,28 14.24,30.4 13.6,31.04 13,31.04 XT1.1
MC02
  Top 0.16: U$1.5 14.14,50.66 13.92,50.88 13.92,53.6 13.76,53.76 12.92,53.76 XT2.1
MISO  (via drill 0.35)
  Top 0.16: U$3.22 19.9,22.14 20.32,22.56 20.32,27.36 21.44,28.48 21.44,29.44 v21.5,29.5 | U$2.21 4.8,33.8 4.8,34.72 7.36,37.28 20.16,37.28 20.51,36.93 v21.5,36.93 | U$1.22 19.9,45.77 v20.06,45.93
  Bottom 0.16: v21.5,29.5 v21.5,36.93 21.5,38.34 21.12,38.72 21.12,41.12 19.84,42.4 19.84,45.71 v20.06,45.93
MOSI  (via drill 0.35)
  Top 0.16: U$3.23 20.4,22.16 20.64,22.4 20.64,27.14 v22.25,28.75 | U$2.19 5.92,32.38 5.92,35.36 7.52,36.96 20,36.96 20.71,36.25 v22.25,36.25 | U$1.23 20.4,44.82 v20.65,45.07
  Bottom 0.16: v22.25,28.75 22.4,28.9 22.4,29.6 21.92,30.08 21.92,35.52 22.25,35.85 v22.25,36.25 22.25,38.07 21.44,38.88 21.44,41.28 20.32,42.4 20.32,44.74 v20.65,45.07
N$2  (via drill 0.3)
  Top 0.16: CHOKE.2 11.29,20.89 12.39,20.89 v12.64,20.64 | U$3.13 14.74,23.52 v14.08,23.52 13.38,24.22 C41.1
  Bottom 0.16: v12.64,20.64 12.64,22.08 v14.08,23.52
N$3
  Top 0.16: U$3.30 23.9,18.18 24.16,17.92 24.84,17.92 C9.2
N$4  (via drill 0.3)
  Top 0.16: U$1.13 14.08,46.66 | 14.08,46.66 13.3,46.66 C7.1 | v13.76,46.08 13.76,46.34 14.08,46.66 | CHOKE1.2 11.5,42.22 v12.8,43.52
  Bottom 0.16: v12.8,43.52 12.8,45.12 v13.76,46.08
N$5
  Top 0.16: U$1.30 23.9,41.29 C2.2
N$6
  Top 0.16: C1.1 39.38,4.29 40,3.68 40.77,3.68 U$4.5
N$7
  Top 0.16: R4.1 19.48,39.41 LED4.A
N$8
  Top 0.16: U$1.6 13.9,50.16 XT2.3
N$10
  Top 0.16: C20.1 39.3,18.62 39.84,18.08 40.53,18.08 U$5.5
N$11
  Top 0.16: DC3.4 30.78,34.4 | 30.78,34.4 30.78,32.1 31.68,31.2 33.92,31.2 34.24,31.52 C15.1 34.4,32.33 34.4,33.44 35.45,34.48 U$6.3 | U$9.8 40.06,43.91 | 40.06,43.91 38.08,41.92 38.08,38.56 37.44,37.92 34.3,37.92 30.78,34.4 | C21.1 39.31,44.66 40.06,43.91
N$12
  Top 0.16: C24.1 39.22,15.51 40.16,14.56 U$8.8 40.33,14.56 37.92,12.16 37.92,9.28 37.12,8.48 34.32,8.48 DC1.4 30.78,1.86 31.36,1.28 33.42,1.28 C11.1 34.4,2.42 34.4,4.64 34.78,5.03 U$4.3
N$14
  Top 0.16: U$8.7 40.17,13.29 38.24,11.36 38.24,8.48 37.28,7.52 36.19,7.52 U$4.1
N$15
  Top 0.16: U$7.1 36.27,52.12 38.24,54.08 38.24,56.96 39.36,58.08 40.67,58.08 U$11.7
N$16
  Top 0.16: U$8.6 40.34,12.03 38.56,10.24 38.56,5.28 36.96,3.68 36.22,3.68 U$4.4
N$17
  Top 0.16: U$7.4 36.95,48.3 37.44,48.8 37.44,52.8 38.56,53.92 38.56,56 39.36,56.8 40.66,56.8 U$11.6
N$18
  Top 0.16: C18.1 39.52,48.95 40.16,48.32 40.84,48.32 U$7.5
N$19
  Top 0.16: U$5.3 35.44,19.27 34.4,18.24 34.4,16.95 C13.1 33.4,15.84 31.68,15.84 30.78,16.74 DC2.4 33.49,22.56 36.96,22.56 37.6,23.2 37.6,27.04 39.88,29.32 U$10.8 39.02,30.82 C23.1
N$20
  Top 0.16: U$10.7 40.05,28.05 37.92,25.92 37.92,22.88 36.8,21.76 35.97,21.76 U$5.1
N$21
  Top 0.16: U$10.6 39.73,26.77 38.4,25.44 38.4,19.52 36.96,18.08 35.98,18.08 U$5.4
N$22
  Top 0.16: C19.1 39.69,33.91 40.32,33.28 40.95,33.28 U$6.5
N$26
  Top 0.16: U$9.7 40.08,42.63 38.4,40.96 38.4,37.44 37.76,36.8 36.55,36.8 U$6.1
N$27
  Top 0.16: U$9.6 40.41,41.37 38.72,39.68 38.72,33.92 37.92,33.12 36.41,33.12 U$6.4
N$28
  Top 0.25: LED2.A 22.65,16.21 R22.1
N$30
  Top 0.16: U$3.6 14.76,27 14.24,27.52 13.28,27.52 12.96,27.84 XT1.3
NRST1
  Top 0.16: U$3.7 14.78,26.5 14.08,27.2 10.79,27.2 PROG.5
NRST2
  Top 0.16: U$1.7 13.86,49.66 13.12,50.4 11.68,50.4 11.04,49.76 10.3,49.76 PROG1.5
SBUS_IN
  Top 0.152: BYP.1 39.06,63.32 39.04,63.3
  Top 0.16: SV1.6 52.73,43.91 50.08,46.24 50.08,55.36 42.14,63.3 39.04,63.3 IC1.2
SCK  (via drill 0.35)
  Top 0.16: U$3.21 19.4,22.12 20,22.72 20,28 v20.75,28.75 | U$2.23 6.06,37.6 20.16,37.6 20.56,37.52 v20.75,37.68 | U$1.21 19.4,45.57 v18.99,45.98
  Bottom 0.16: v20.75,28.75 20.8,28.8 20.8,29.92 21.12,30.24 21.12,36.32 20.75,36.69 v20.75,37.68 20.75,40.85 19.36,42.24 19.36,45.61 v18.99,45.98
TCK1  (via drill 0.35)
  Top 0.16: PROG.2 9.15,30.16 v9.07,30.24 | U$3.49 24.9,30.62 v24.4,30.12
  Bottom 0.16: v9.07,30.24 9.6,29.71 9.6,29.6 11.04,28.16 15.52,28.16 16,27.68 22.72,27.68 24.4,29.36 v24.4,30.12
TCK2  (via drill 0.35)
  Top 0.16: v8.5,52.82 10.16,52.82 PROG1.2 | U$1.49 24.9,52.98 v24.83,52.91
  Bottom 0.16: v24.83,52.91 24.59,52.91 23.68,52 9.32,52 v8.5,52.82
TMS1  (via drill 0.35)
  Top 0.16: PROG.4 9.15,28.16 v9.07,28.24 | U$3.46 25.78,28.5 25.12,27.84 24.52,27.84 v24.45,27.77
  Bottom 0.16: v9.07,28.24 9.47,27.84 15.36,27.84 15.84,27.36 24.04,27.36 v24.45,27.77
TMS2  (via drill 0.35)
  Top 0.16: v8.34,50.66 10.66,50.66 10.72,50.72 PROG1.4 | U$1.46 25.95,51.66 v24.99,50.7
  Bottom 0.16: v8.34,50.66 9.24,51.56 9.34,51.66 9.36,51.68 23.52,51.68 24.5,50.7 v24.99,50.7
USART1_RX
  Top 0.16: U$3.17 15.68,20 11.04,24.64 11.04,24.86 PROG.7
USART1_TX
  Top 0.16: PROG.6 12.08,26.16 12.48,25.76 12.48,23.84 14.24,22.08 15.32,22.08 U$3.16
USART2_RX
  Top 0.16: 10.38,47.84 PROG1.7 10.4,47.59 10.4,47.2 14.44,43.16 U$1.17
USART2_TX
  Top 0.16: 10.51,48.48 PROG1.6 10.35,48.64 11.36,48.64 11.52,48.48 11.52,46.88 13.24,45.16 U$1.16
XBEE_RX
  Top 0.152: U$2.8 2.23,17.13 1.24,18.12 1.24,39.26 2.38,40.4 5.18,40.4 5.93,41.15 5.93,59.81 9.95,63.83 28.47,63.83 30.72,66.08 39.8,66.08 50.39,55.49 50.39,55.06 SV1.3
XBEE_TX  (via drill 0.3)
  Top 0.152: 31.52,63.52 31.88,63.88 31.88,65 32.02,65.13 36.97,65.13 37.94,64.16 BYP.2
  Top 0.16: 34.65,63.91 IC1.4 33.71,63.95 33.28,63.52 31.52,63.52 10.08,63.52 6.24,59.68 6.24,39.84 v6.4,39.68 | v6.4,28.48 6.4,20.8 5.44,19.84 3.54,19.84 U$2.10
  Bottom 0.16: v6.4,39.68 v6.4,28.48

### Text on the board
tNames: mini cheetah / SPIne V1.2 / ben katz / 3/19 | + | -
bNames: hello / you're not supposed to be here